# EAGLE design 304_usb_serial (EAGLE 9.6.2)
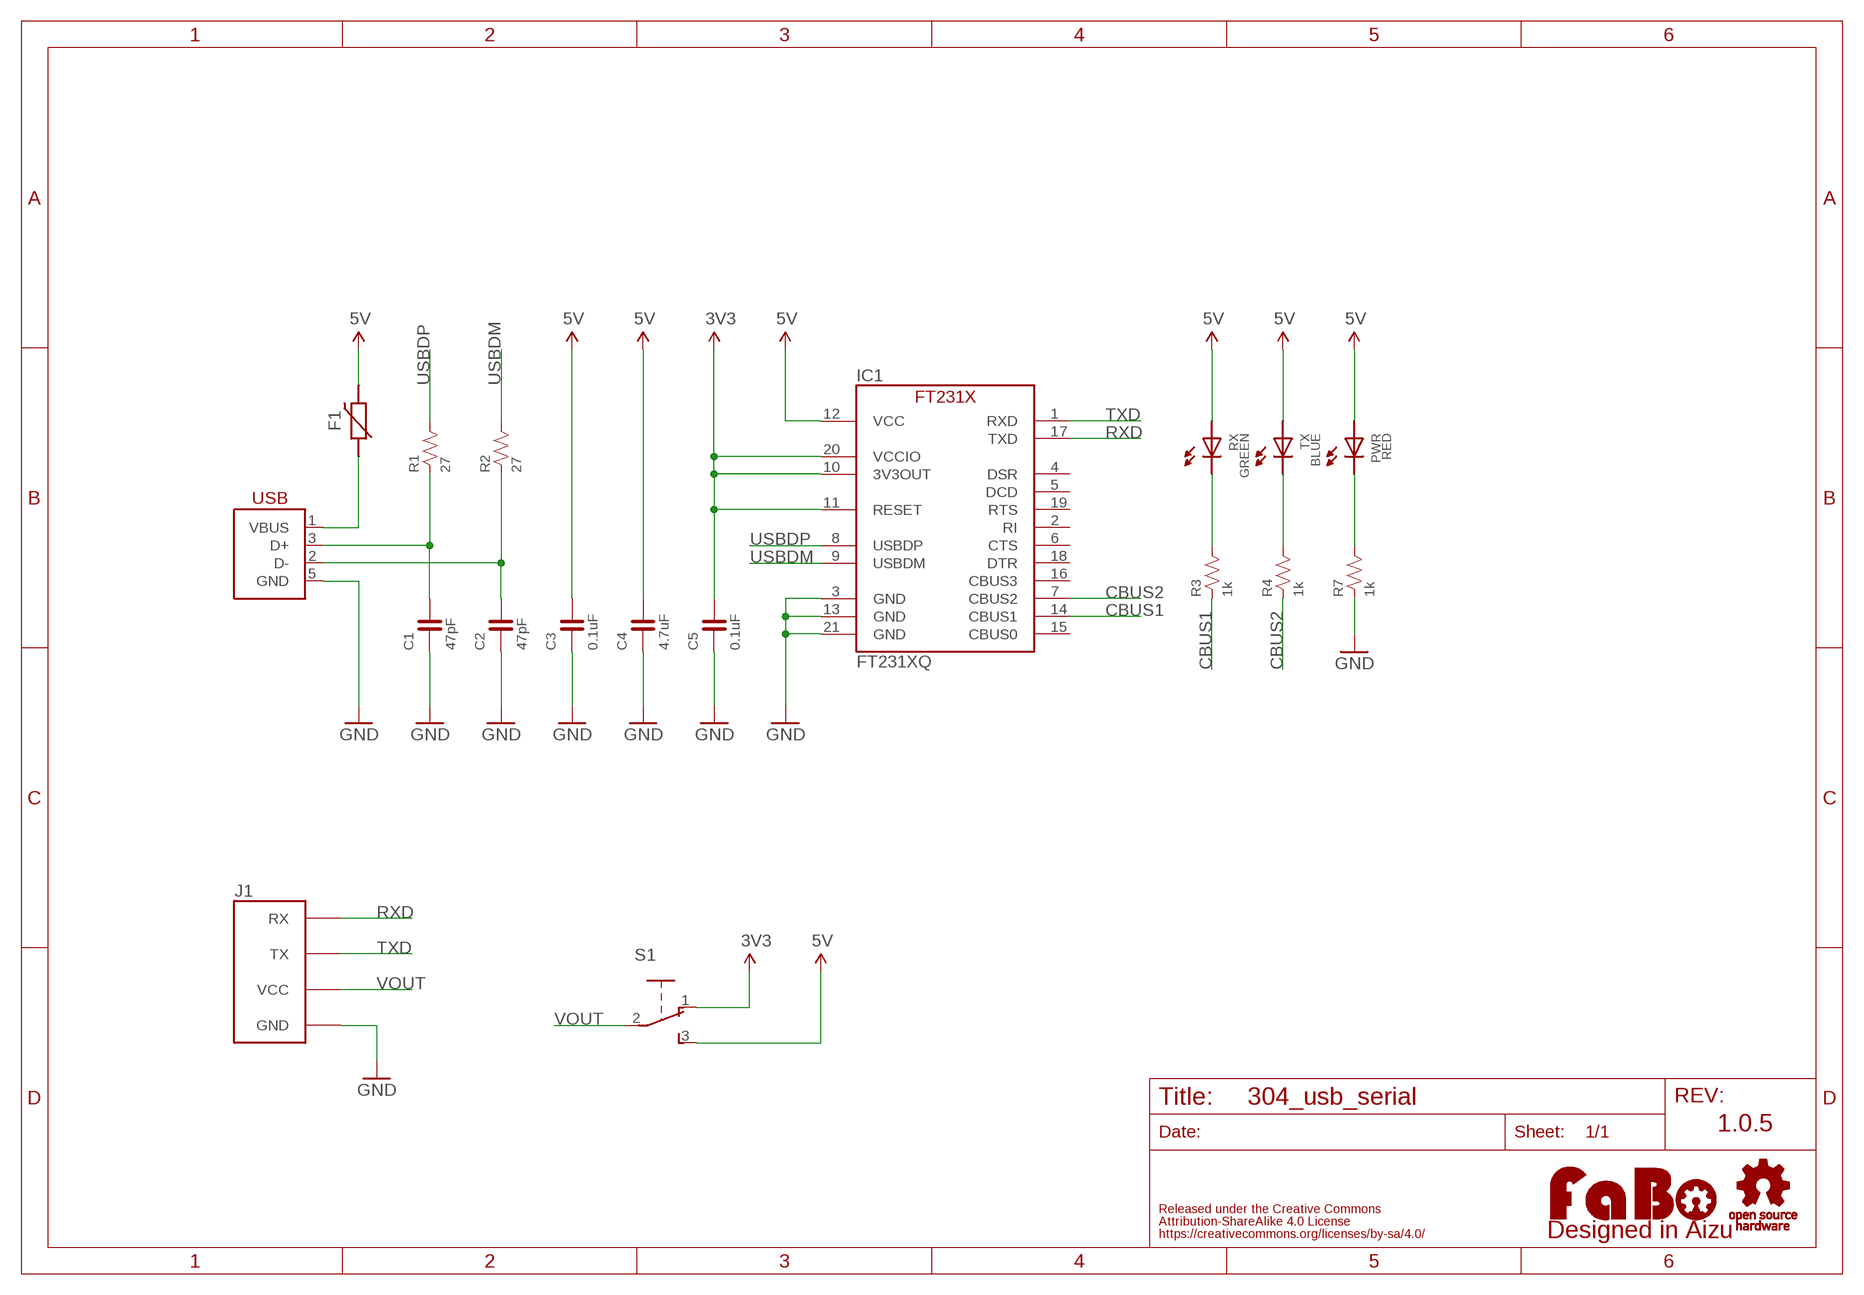
[diagram p0: schematic, sheet 1]

## Parts
C1  47pF  CAPACITOR-0603_NARROW  [0603-NARROW]
C2  47pF  CAPACITOR-0603_NARROW  [0603-NARROW]
C3  0.1uF  CAPACITOR-0603_NARROW  [0603-NARROW]
C4  4.7uF  CAPACITOR-0603_NARROW  [0603-NARROW]
C5  0.1uF  CAPACITOR-0603_NARROW  [0603-NARROW]
F1  POLYSWITCH  [NANOSMDC035F]
IC1  FT231XQ  [QFN-20_FT231X]
J1  FABO_BRICK_SERIAL-USB  [FABO_BRICK_SERIAL_USB]
LOGO1  LOGO_FABO-M_BOTTOM  [LOGO_FABO_M_BOTTOM]
PWR  RED  LED-0603-NARROW  [0603-NARROW]
R1  27  RESISTOR-0603-NARROW  [0603-NARROW]
R2  27  RESISTOR-0603-NARROW  [0603-NARROW]
R3  1k  RESISTOR-0603-NARROW  [0603-NARROW]
R4  1k  RESISTOR-0603-NARROW  [0603-NARROW]
R7  1k  RESISTOR-0603-NARROW  [0603-NARROW]
RX  GREEN  LED-0603-NARROW  [0603-NARROW]
S1  SLIDE-SSSS810701  [SSSS810701]
TX  BLUE  LED-0603-NARROW  [0603-NARROW]
U$3  LOGO_OSHW-M_BOTTOM  [LOGO_OSHW_M_BOTTOM]
USB1  USB-MICRO_B_SMT_HIROSE  [ZX62R-B-5P]

## Nets
3V3: C5.2 IC1.10(3V3OUT) IC1.11(RESET) IC1.20(VCCIO) S1.1
5V: C3.2 C4.2 F1.2 IC1.12(VCC) PWR.ANODE RX.ANODE S1.3 TX.ANODE
CBUS1: IC1.14(CBUS1) R3.1
CBUS2: IC1.7(CBUS2) R4.1
GND: C1.1 C2.1 C3.1 C4.1 C5.1 IC1.3(GND) IC1.13(GND) IC1.21(GND) J1.GND R7.1 USB1.5(GND)
N$1: PWR.CATHODE R7.2
N$3: C2.2 R2.1 USB1.2(D-)
N$4: C1.2 R1.1 USB1.3(D+)
N$33: R3.2 RX.CATHODE
N$35: R4.2 TX.CATHODE
RXD: IC1.17(TXD) J1.RX
TXD: IC1.1(RXD) J1.TX
USBDM: IC1.9(USBDM) R2.2
USBDP: IC1.8(USBDP) R1.2
VBUS: F1.1 USB1.1(VBUS)
VOUT: J1.VCC S1.2
Unconnected: IC1.2(RI) IC1.4(DSR) IC1.5(DCD) IC1.6(CTS) IC1.15(CBUS0) IC1.16(CBUS3) IC1.18(DTR) IC1.19(RTS)

## Notes on the sheet
- 1.0.5

## Library data of the parts
C1-C5 = FaBo-Capacitor:CAPACITOR: CAPACITOR
F1 = FaBo-Parts:POLYSWITCH
IC1 = FaBo-USB:FT231X
J1 = FaBo-Template:FABO_BRICK_SERIAL: FaBo Brick Serial
LOGO1 = component:LOGO_FABO
PWR RX TX = FaBo-LED:LED
R1-R4 R7 = FaBo-Resistors:RESISTOR: RESISTOR
S1 = FaBo-Switch:SLIDE
U$3 = FaBo-Logo:LOGO_OSHW
USB1 = FaBo-USB:USB

## Board
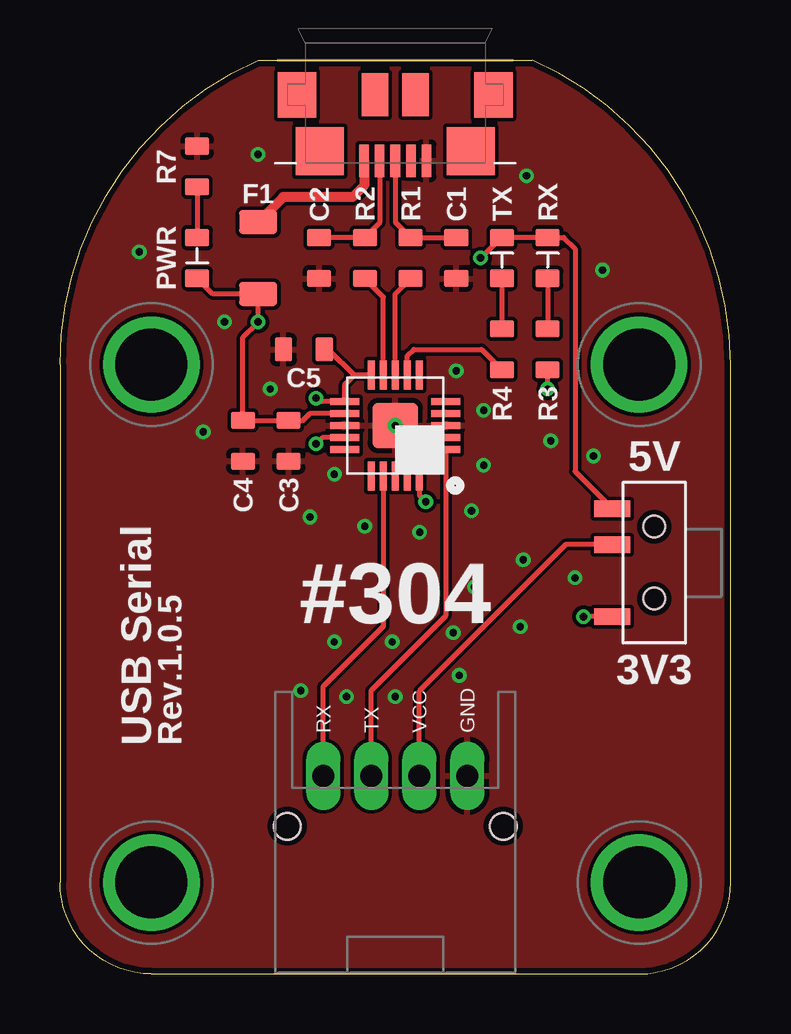
[diagram p1: board, top side]
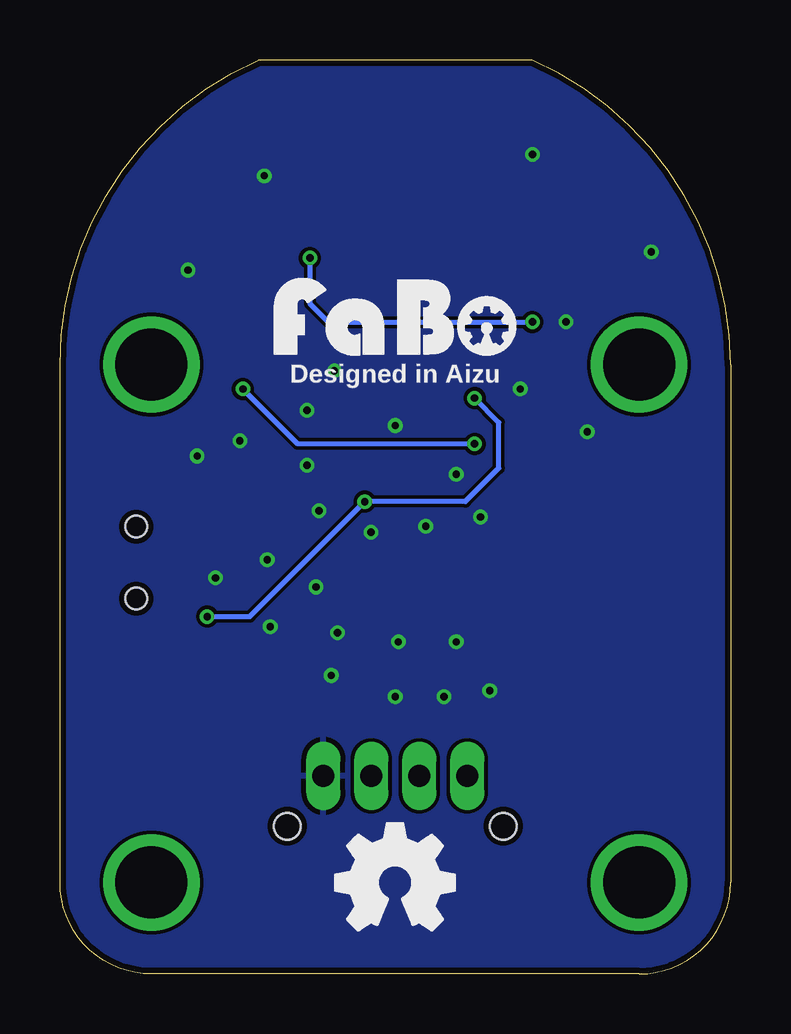
[diagram p2: board, bottom side, seen from below]

Size 27.94 x 38.1 mm. Coordinates in mm from the lower left corner, seen from the top.
Copper layers (1*16): Top 0.035mm / dielectric 1.6mm / Bottom 0.035mm
Design rules "PCBway": minimum track width 6mil, minimum drill 12mil, track to track 6mil, track to pad 6mil, pad to pad 6mil, via to via 6mil, smd to smd 6mil, copper to edge 10mil, drill to drill 10mil, minimum pad ring 10mil, minimum via ring 6mil, stop-mask expansion 2mil, vias tented up to drill 100mil, thermal gap 8mil

### Footprints (pad centres in the part's own frame; a part is rotated, then mirrored left to right if it is on the bottom)
0603-NARROW = smd 0.71 x 1: 1 -0.85,0; 2 0.85,0
NANOSMDC035F = smd 1 x 1.6: 1 -1.5,0; 2 1.5,0
QFN-20_FT231X = smd 1.2 x 0.3: 1 -2.1,1; 2 -2.1,0.5; 3 -2.1,0; 4 -2.1,-0.5; 5 -2.1,-1; 11 2.1,-1; 12 2.1,-0.5; 13 2.1,0; 14 2.1,0.5; 15 2.1,1 | smd 0.3 x 1.2: 6 -1,-2.1; 7 -0.5,-2.1; 8 0,-2.1; 9 0.5,-2.1; 10 1,-2.1; 16 1,2.1; 17 0.5,2.1; 18 0,2.1; 19 -0.5,2.1; 20 -1,2.1 | smd 1.9 x 1.9: 21 0,0
FABO_BRICK_SERIAL_USB = drill 0.9 pad 1.422 long: GND 3,-10.795; RX -3,-10.795; TX -1,-10.795; VCC 1,-10.795 | drill 3 pad 3.81: P$1 -10.16,6.35; P$2 10.16,6.35; P$3 -10.16,-15.24; P$4 10.16,-15.24 | hole 1.1: -4.5,-12.895; 4.5,-12.895
0603-NARROW' = smd 0.75 x 1: ANODE -0.85,0; CATHODE 0.85,0
SSSS810701 = smd 0.7 x 1.5: 1 -2.25,1.75; 2 0.75,1.75; 3 2.25,1.75 | hole 0.9: -1.5,0; 1.5,0
ZX62R-B-5P = smd 0.4 x 1.35: 1 1.3,4.2; 2 0.65,4.2; 3 0,4.2; 4 -0.65,4.2; 5 -1.3,4.2 | smd 2 x 2: 6 3.15,3.8; 7 -3.15,3.8 | smd 1.6 x 1.9: 8 4.1,1.45; 11 -4.1,1.45 | smd 1.1 x 1.8: 9 0.85,1.45; 10 -0.85,1.45

### Placement (x,y rotation side)
C1  16.51,29.84 90 top
C2  10.79,29.84 90 top
C3  9.53,22.23 90 top
C4  7.62,22.23 90 top
C5  10.16,26.04 0 top
F1  8.26,29.84 270 top
IC1  13.97,22.86 180 top
J1  13.97,19.05 0 top
LOGO1  13.97,25.4 0 top
PWR  RED  [0603-NARROW']  5.71,29.84 90 top
R1  14.61,29.84 270 top
R2  12.7,29.84 270 top
R3  20.32,26.04 90 top
R4  18.41,26.04 90 top
R7  5.71,33.66 270 top
RX  GREEN  [0603-NARROW']  20.32,29.84 270 top
S1  24.77,17.14 90 top
TX  BLUE  [0603-NARROW']  18.41,29.84 270 top
U$3  13.97,3.81 0 top
USB1  13.97,38.1 180 top

### Tracks (layer width: path | path; a pad name or v marks a point on that pad's centre or on a via)
3V3  (via drill 0.3)
  Top 0.203: IC1.10 12.26,24.96 | 12.26,24.96 11.87,24.57 IC1.11 10.81,23.86 v10.67,24 | C5.2 11.19,26.04 12.26,24.96 | IC1.20 14.97,19.95 v15.24,19.68 | S1.1 v21.81,14.89
  Bottom 0.203: v21.81,14.89 20.03,14.89 v15.24,19.68 11.05,19.68 9.65,21.08 9.65,22.99 v10.67,24
5V  (via drill 0.3)
  Top 0.203: IC1.12 10.41,23.36 10.12,23.07 C3.2 C4.2 7.62,26.54 v8.26,27.18 F1.2 6.37,28.34 PWR.ANODE | S1.3 21.46,20.95 21.46,30.23 20.99,30.7 RX.ANODE TX.ANODE 18.38,30.7 v17.53,29.84
  Bottom 0.203: v17.53,29.84 17.53,27.94 16.76,27.18 v8.26,27.18
CBUS1  (via drill 0.3)
  Top 0.203: IC1.14 10.93,22.36 v10.67,22.1 | v20.32,24.38 R3.1
  Bottom 0.203: v10.67,22.1 18.03,22.1 v20.32,24.38
CBUS2
  Top 0.203: IC1.7 14.47,25.77 14.73,26.04 17.57,26.04 R4.1
GND  (via drill 0.3)
  other vias: 20.45,22.23 21.46,16.51 22.23,21.59 22.61,29.34 19.43,33.27 8.26,34.16 3.3,30.1 6.86,27.18 8.76,24.38 5.97,22.61 11.43,20.83 10.41,19.05 12.7,18.67 14.99,18.41 17.14,19.3 17.65,21.21 16.51,25.15 17.65,23.5 19.3,17.27 17.27,16.13 19.18,14.48 16.64,12.45 13.97,11.56 11.94,11.56 10.03,11.81 11.43,13.84 13.84,13.84 16.38,14.22 13.97,22.86
  pour Bottom: 0,0 27.94,0 27.94,38.1 0,38.1
  pour Top: 0,0 27.94,0 27.94,38.1 0,38.1
N$1
  Top 0.203: R7.2 PWR.CATHODE
N$3
  Top 0.203: USB1.2 13.32,31.32 R2.1 C2.2
N$4
  Top 0.203: USB1.3 13.97,31.33 R1.1 C1.2
N$33
  Top 0.203: RX.CATHODE R3.2
N$35
  Top 0.203: TX.CATHODE R4.2
RXD
  Top 0.203: IC1.17 13.47,14.49 10.97,11.99 J1.RX
TXD
  Top 0.203: IC1.1 16.07,14.93 12.97,11.83 J1.TX
USBDM
  Top 0.203: IC1.9 13.47,28.23 R2.2
USBDP
  Top 0.203: IC1.8 13.97,28.36 R1.2
VBUS
  Top 0.406: USB1.1 12.67,32.86 12.19,32.38 9.29,32.38 F1.1
VOUT
  Top 0.203: S1.2 21.07,17.89 14.97,11.79 J1.VCC

### Text on the board
tPlace: 5V | #304 | 3V3 | USB Serial | Rev.1.0.5
bPlace: Designed in Aizu